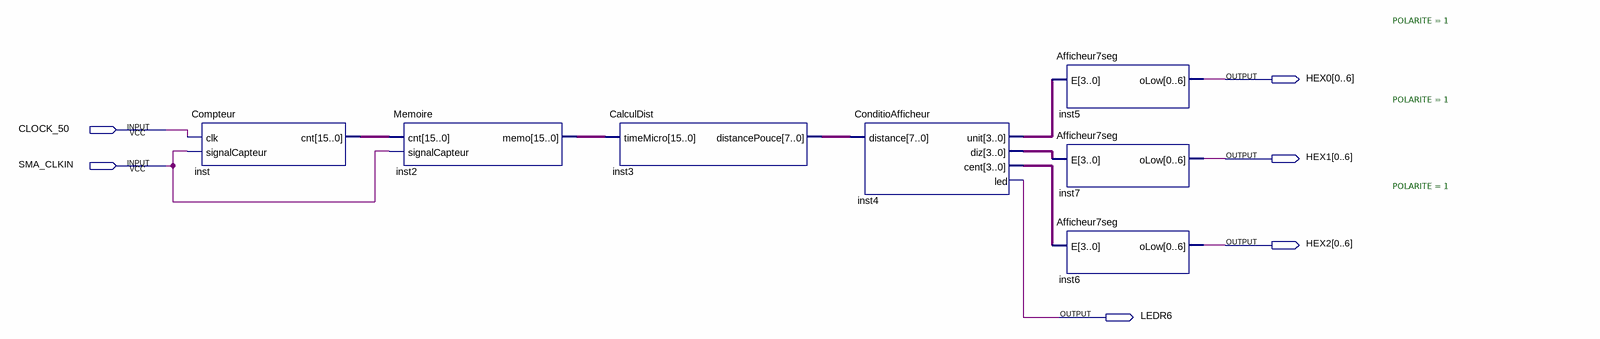
[diagram p0: schematic sheet]
// Quartus schematic TelemetreBlock.bdf as structural Verilog: 7 symbols, 6 pins
module TelemetreBlock (
  input  CLOCK_50,
  input  SMA_CLKIN,
  output [0:6] HEX0,
  output [0:6] HEX1,
  output [0:6] HEX2,
  output LEDR6
);

  wire [3:0] inst4_cent, inst4_diz, inst4_unit;
  wire [7:0] inst3_distancepouce;
  wire [15:0] inst2_memo, inst_cnt;

  Compteur inst (.clk(CLOCK_50), .signalCapteur(SMA_CLKIN), .cnt(inst_cnt));
  Memoire inst2 (.cnt(inst_cnt), .signalCapteur(SMA_CLKIN), .memo(inst2_memo));
  CalculDist inst3 (.timeMicro(inst2_memo), .distancePouce(inst3_distancepouce));
  ConditioAfficheur inst4 (
    .distance(inst3_distancepouce), .unit(inst4_unit), .diz(inst4_diz), .cent(inst4_cent), .led(LEDR6));
  Afficheur7seg #(.POLARITE(1)) inst5 (.E(inst4_unit), .oLow(HEX0));
  Afficheur7seg #(.POLARITE(1)) inst7 (.E(inst4_diz), .oLow(HEX1));
  Afficheur7seg #(.POLARITE(1)) inst6 (.E(inst4_cent), .oLow(HEX2));
endmodule
